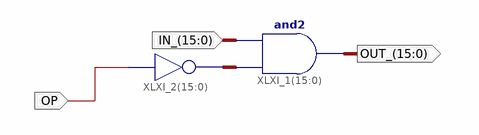
[diagram p0: schematic sheet 1]
// Xilinx ISE schematic AND16Bit.sch (spartan6) as structural Verilog: 2 symbols, 3 ports
module AND16Bit (
  input  [15:0] IN_,
  input  OP,
  output [15:0] OUT_
);

  wire [15:0] XLXN_1;

  assign OUT_ = XLXN_1 & IN_;  // and2 XLXI_1[15..0], 16 bits wide
  assign XLXN_1 = ~{16{OP}};  // inv XLXI_2[15..0], 16 bits wide
endmodule
